# EAGLE design Strain Gauge Amplifier (EAGLE 9.6.2)
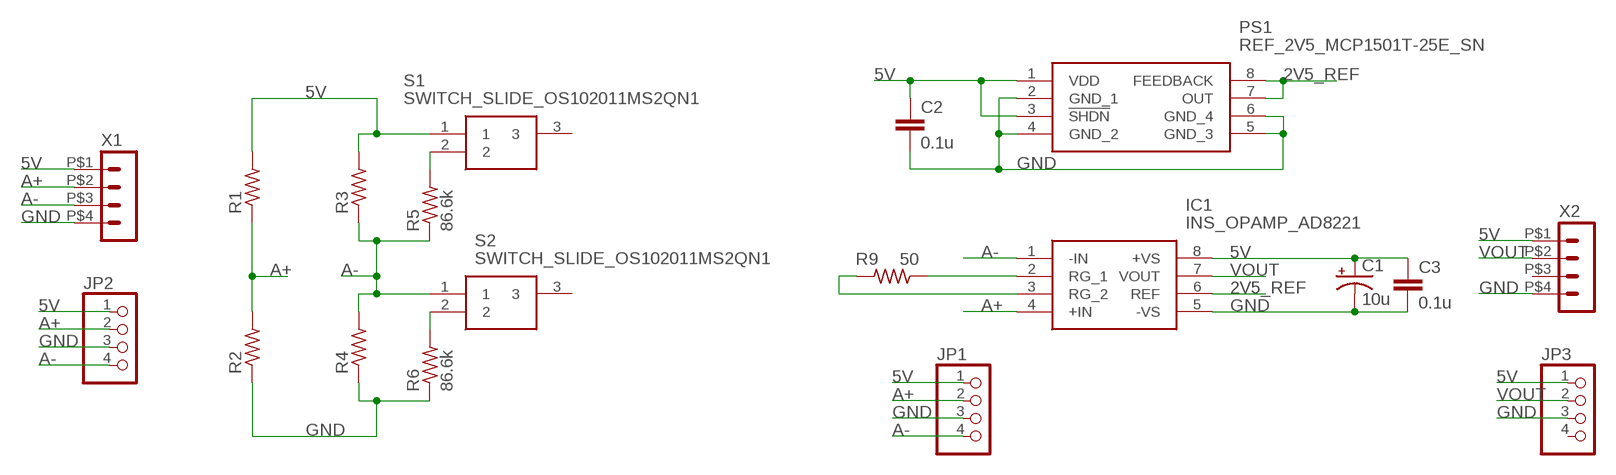
[diagram p0: schematic, sheet 1]

## Parts
C1  10u  CAP_THTE2-5  [E2-5]
C2  0.1u  CAP_SMDC0603  [C0603]
C3  0.1u  CAP_SMDC0603  [C0603]
IC1  INS_OPAMP_AD8221  [SOP65P490X110-8N]
JP1  PINHD-1X4  [1X04]
JP2  PINHD-1X4  [1X04]
JP3  PINHD-1X4  [1X04]
PS1  REF_2V5_MCP1501T-25E_SN  [SOIC127P600X175-8N]
R1  RES_SMDR1206  [R1206]
R2  RES_SMDR1206  [R1206]
R3  RES_SMDR1206  [R1206]
R4  RES_SMDR1206  [R1206]
R5  86.6k  RES_SMDR0603  [R0603]
R6  86.6k  RES_SMDR0603  [R0603]
R9  50  RES_SMDR0603  [R0603]
S1  SWITCH_SLIDE_OS102011MS2QN1  [OS102011MA1QN1]
S2  SWITCH_SLIDE_OS102011MS2QN1  [OS102011MA1QN1]
X1  HEADER_POS4_43045-0401  [43045-0400]
X2  HEADER_POS4_43045-0401  [43045-0400]

## Nets
2V5_REF: IC1.6(REF) PS1.7(OUT) PS1.8(FEEDBACK)
5V: C1.+ C2.1 C3.1 IC1.8(+VS) JP1.1 JP2.1 JP3.1 PS1.1(VDD) PS1.3(!SHDN) R1.2 R3.2 S1.1 X1.P$1 X2.P$1
A+: IC1.4(+IN) JP1.2 JP2.2 R1.1 R2.2 X1.P$2
A-: IC1.1(-IN) JP1.4 JP2.4 R3.1 R4.2 R5.1 S2.1 X1.P$3
GND: C1.- C2.2 C3.2 IC1.5(-VS) JP1.3 JP2.3 JP3.3 PS1.2(GND_1) PS1.4(GND_2) PS1.5(GND_3) PS1.6(GND_4) R2.1 R4.1 R6.1 X1.P$4 X2.P$4
N$1: R6.2 S2.2
N$2: IC1.2(RG_1) R9.1
N$3: IC1.3(RG_2) R9.2
N$5: R5.2 S1.2
VOUT: IC1.7(VOUT) JP3.2 X2.P$2
Unconnected: JP3.4 S1.3 S2.3 X2.P$3

## Library data of the parts
C1 = GTOR - Passive Components:CAP_THT: POLARIZED CAPACITOR, American symbol; SPICEPREFIX: C
C2 C3 = GTOR - Passive Components:CAP_SMD: CAPACITOR, European symbol; SPICEPREFIX: C
IC1 = GTOR - Active Components:INS_OPAMP_AD8221: ANALOG DEVICES - AD8221ARMZ-R7 - INSTRUMENTATION AMPLIFIER, 825KHZ, MSOP8 Source: Datasheet <http://www.analog.com/media/en/technical-documentation/data-sheets/AD8221.pdf>; ARROW_PART_NUMBER: AD8221ARMZ-R7; ARROW_PRICE-STOCK: https://www.arrow.com/en/products/ad8221armz-r7/analog-devices; DESCRIPTION: ANALOG DEVICES - AD8221ARMZ-R7 - INSTRUMENTATION AMPLIFIER, 825KHZ, MSOP8; HEIGHT: 1.1mm; MANUFACTURER_NAME: Analog Devices; MANUFACTURER_PART_NUMBER: AD8221ARMZ-R7; MOUSER_PART_NUMBER: 584-AD8221ARMZ-R7; MOUSER_PRICE-STOCK: https://www.mouser.co.uk/ProductDetail/Analog-Devices/AD8221ARMZ-R7?qs=%2FtpEQrCGXCyX3gxQaWBZmg%3D%3D
JP1-JP3 = GTOR - Connectors:PINHD-1X4: PIN HEADER
PS1 = GTOR - Active Components:REF_2V5_MCP1501T-25E_SN: Voltage References High Prec Buffered Voltage Reference Source: Datasheet <http://ww1.microchip.com/downloads/en/DeviceDoc/20005474E.pdf>; ARROW_PART_NUMBER: MCP1501T-25E/SN; ARROW_PRICE-STOCK: https://www.arrow.com/en/products/mcp1501t-25esn/microchip-technology; DESCRIPTION: Voltage References High Prec Buffered Voltage Reference; HEIGHT: 1.75mm; MANUFACTURER_NAME: Microchip; MANUFACTURER_PART_NUMBER: MCP1501T-25E/SN; MOUSER_PART_NUMBER: 579-MCP1501T-25E/SN; MOUSER_PRICE-STOCK: https://www.mouser.co.uk/ProductDetail/Microchip-Technology/MCP1501T-25E-SN?qs=BA62vJVifGq6P0twjIFVRA%3D%3D
R1-R6 R9 = GTOR - Passive Components:RES_SMD: RESISTOR, American symbol; SPICEPREFIX: R
S1 S2 = GTOR - Active Components:SWITCH_SLIDE_OS102011MS2QN1: Switch Slide Miniature SPDT 0.1A 12VDC Through Hole Slide Switch SPDT On-On 0.1 A@ 12 V dc Slide Source: Datasheet <http://www.ckswitches.com/media/1428/os.pdf>; ARROW_PART_NUMBER: OS102011MS2QN1; ARROW_PRICE-STOCK: https://www.arrow.com/en/products/os102011ms2qn1/ck; DESCRIPTION: Switch Slide Miniature SPDT 0.1A 12VDC Through Hole Slide Switch SPDT On-On 0.1 A@ 12 V dc Slide; HEIGHT: mm; MANUFACTURER_NAME: C & K COMPONENTS; MANUFACTURER_PART_NUMBER: OS102011MS2QN1; MOUSER_PART_NUMBER: 611-OS102011MS2QN1; MOUSER_PRICE-STOCK: https://www.mouser.co.uk/ProductDetail/CK/OS102011MS2QN1?qs=WtljUlYws5RvQ1hEv876nQ%3D%3D
X1 X2 = GTOR - Microfit Connector:HEADER_POS4_?: Molex - Micro-Fit 3.0 Series connector, 3.00mm (0.118") pitch header, 4 positions.

## Board
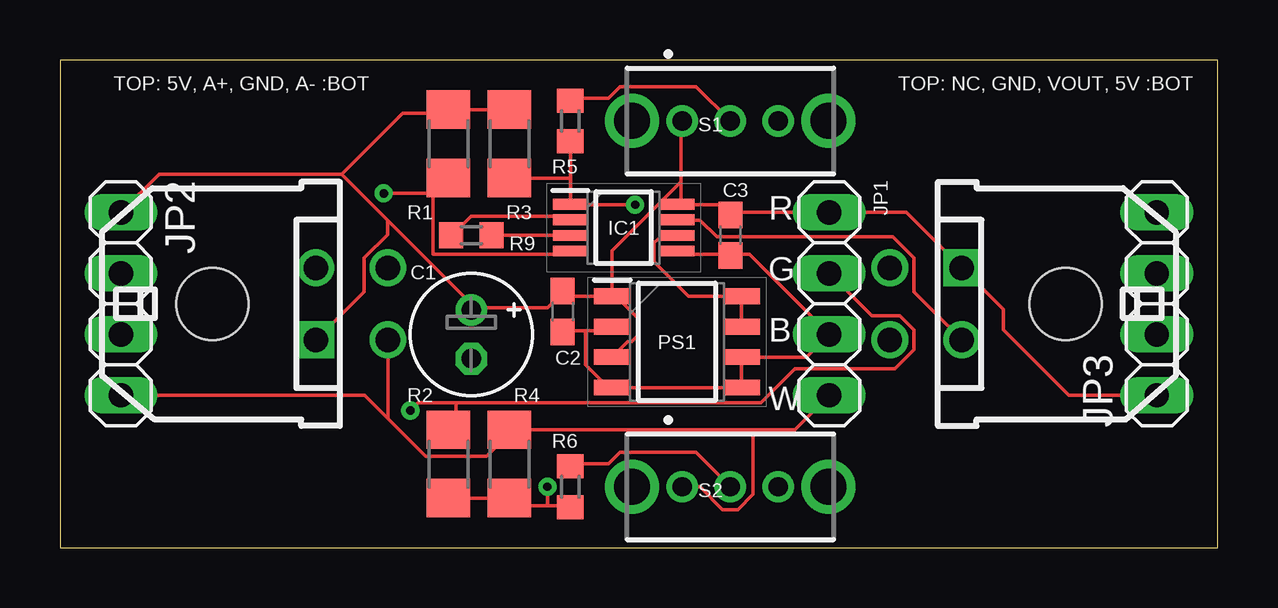
[diagram p1: board, top side]
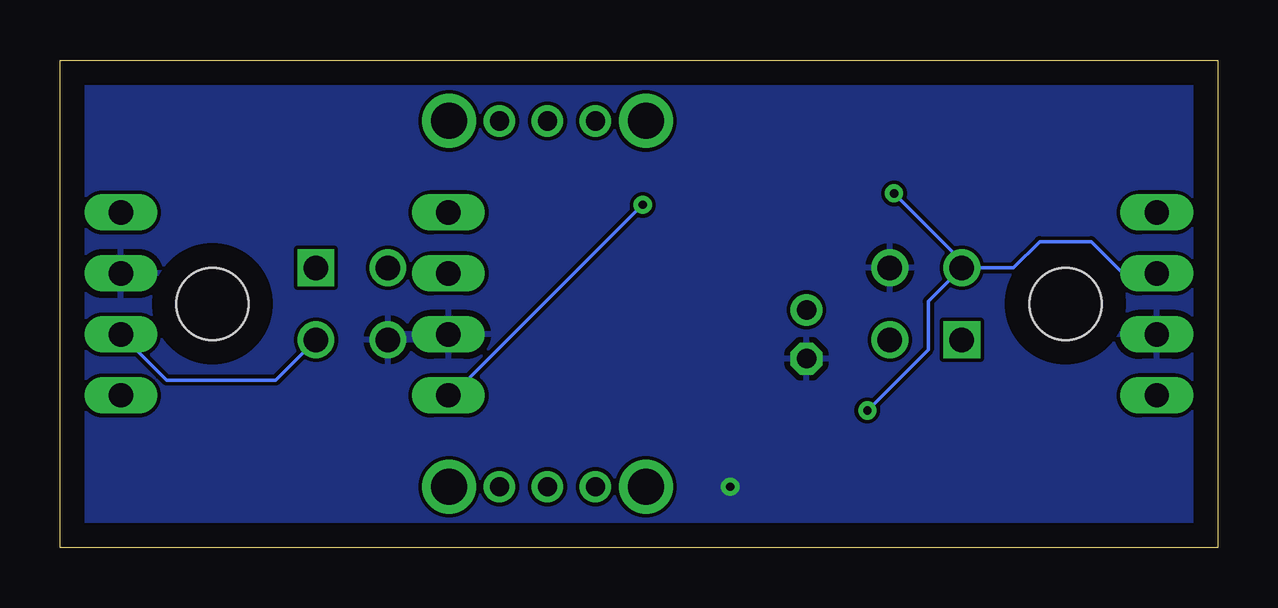
[diagram p2: board, bottom side, seen from below]

Size 48.26 x 20.32 mm. Coordinates in mm from the lower left corner, seen from the top.
Outline: 0,0 48.26,0 48.26,20.32 0,20.32 0,0
Copper layers (1*16): Top 0.035mm / dielectric 1.5mm / Bottom 0.035mm
Design rules "default": minimum track width 6mil, minimum drill 0.35mm, track to track 6mil, track to pad 6mil, pad to pad 6mil, via to via 6mil, smd to smd 6mil, copper to edge 40mil, drill to drill 6mil, minimum pad ring 10mil, minimum via ring 8mil, stop-mask expansion 4mil, vias tented up to drill 0mil, thermal gap 10mil

### Footprints (pad centres in the part's own frame; a part is rotated, then mirrored left to right if it is on the bottom)
E2-5 = drill 0.813 pad 1.27: + -1.016,0 | drill 0.813 pad 1.27 octagon: - 1.016,0
C0603 = smd 1.1 x 1: 1 -0.85,0; 2 0.85,0
SOP65P490X110-8N = smd 1.45 x 0.45: 1 -2.225,0.975; 2 -2.225,0.325; 3 -2.225,-0.325; 4 -2.225,-0.975; 5 2.225,-0.975; 6 2.225,-0.325; 7 2.225,0.325; 8 2.225,0.975
1X04 = drill 1.016 long: 1 -3.81,0; 2 -1.27,0; 3 1.27,0; 4 3.81,0
SOIC127P600X175-8N = smd 1.5 x 0.65: 1 -2.7,1.905; 2 -2.7,0.635; 3 -2.7,-0.635; 4 -2.7,-1.905; 5 2.7,-1.905; 6 2.7,-0.635; 7 2.7,0.635; 8 2.7,1.905
R1206 = smd 1.6 x 1.803: 1 -1.422,0; 2 1.422,0
R0603 = smd 1 x 1.1: 1 -0.85,0; 2 0.85,0
OS102011MA1QN1 = drill 0.8 pad 1.3: 1 -2,0; 2 0,0; 3 2,0 | drill 1.5 pad 2.25: 4 -4.1,0; 5 4.1,0
43045-0400 = drill 1.02 square: P$1 1.5,4.32 | drill 1.02: P$2 -1.5,4.32; P$3 1.5,7.32; P$4 -1.5,7.32 | hole 3: 0,0

### Placement (x,y rotation side)
C1  17.14,8.89 270 top
C2  20.95,9.84 270 top
C3  27.94,13.02 270 top
IC1  23.5,13.34 0 top
JP1  32.07,10.16 270 top
JP2  2.54,10.16 270 top
JP3  45.72,10.16 90 top
PS1  25.72,8.57 0 top
R1  16.19,16.83 90 top
R2  16.19,3.49 90 top
R3  18.73,16.83 90 top
R4  18.73,3.49 90 top
R5  21.27,17.78 90 top
R6  21.27,2.54 90 top
R9  17.14,13.02 0 top
S1  27.94,17.78 0 top
S2  27.94,2.54 0 top
X1  6.35,10.16 270 top
X2  41.91,10.16 90 top

### Tracks (layer width: path | path; a pad name or v marks a point on that pad's centre or on a via)
2V5_REF
  Top 0.152: PS1.8 26.19,10.48 24.77,11.91 24.77,12.7 24.92,12.86 25.72,12.86 IC1.6 | PS1.8 PS1.7 | PS1.8
5V
  Top 0.152: R3.2 R1.2 16.19,18.1 14.29,18.1 11.75,15.56 | PS1.3 23.65,8.57 23.81,8.57 24.13,8.89 24.13,9.53 23.18,10.48 PS1.1 | 17.3,10 20.32,10 20.95,10.64 C2.1 21.17,10.48 PS1.1 | 17.3,10 17.14,10 C1.+ 17.3,10 | 25.88,15.24 25.88,17.78 S1.1 | 25.88,15.24 25.88,14.45 IC1.8 25.88,14.29 27.62,14.29 27.94,13.97 | 27.94,13.97 JP1.1 35.28,13.97 X2.P$1 39.32,9.93 39.32,9.09 42.05,6.35 JP3.1 | 27.94,13.97 C3.1 | 17.3,10 13.65,13.65 | 13.65,13.65 11.75,15.56 | PS1.1 23.02,12.38 25.88,15.24 | 11.75,15.56 4.13,15.56 JP2.1 | 13.65,13.65 13.65,13.05 12.68,12.07 12.68,10.67 X1.P$1
A+  (via drill 0.35)
  Top 0.152: 15.56,14.76 15.56,12.22 21.11,12.22 IC1.4 | 15.56,14.76 16.19,15.4 R1.1 15.56,14.76 | 15.56,14.76 v13.49,14.76 | JP1.2 33.84,9.65 35,9.65 35.58,9.07 35.58,8.25 34.8,7.46 30.64,7.46 29.21,6.03 16.51,6.03 | v14.61,5.71 14.92,6.03 16.51,6.03 | 16.51,6.03 16.51,5.23 R2.2
  Bottom 0.152: v13.49,14.76 10.67,11.94 X1.P$2 | JP2.2 3.95,11.43 5.28,12.75 7.42,12.75 8.52,11.66 X1.P$2 | X1.P$2 12.06,10.27 12.06,8.26 v14.61,5.71
A-  (via drill 0.35)
  Top 0.152: 21.27,15.4 21.27,14.45 IC1.1 21.27,14.29 v23.97,14.29 | 21.27,15.4 R5.1 | 21.27,15.4 18.73,15.4 R3.1 | 28.89,4.92 18.73,4.92 R4.2 18.73,4.76 17.78,3.81 15.24,3.81 13.67,5.38 | S2.1 26.67,2.54 27.62,1.59 28.26,1.59 28.89,2.22 28.89,4.92 | 13.67,5.38 X1.P$3 | JP2.4 12.7,6.35 13.67,5.38 | JP1.4 30.64,4.92 28.89,4.92
  Bottom 0.152: v23.97,14.29 31.91,6.35 JP1.4
GND  (via drill 0.35)
  Top 0.152: PS1.5 PS1.6 31.11,7.94 JP1.3 28.73,12.22 27.94,12.22 | 21.91,9.05 22.7,9.05 22.86,9.21 PS1.2 | 21.91,9.05 20.95,9.05 C2.2 | 21.91,9.05 21.91,7.62 22.86,6.67 PS1.4 PS1.5 | PS1.5 | 20.32,1.75 19.05,1.75 R4.1 | 20.32,1.75 21.27,1.75 R6.1 | R4.1 R2.1 | R4.1 | 27.94,12.22 25.88,12.22 IC1.5 | 27.94,12.22 C3.2 | v20.32,2.54 20.32,1.75
  pour Bottom: 0,20.32 0,0 48.26,0 48.26,20.32
N$1
  Top 0.152: S2.2 26.51,3.97 23.34,3.97 22.86,3.49 21.27,3.49 R6.2
N$2
  Top 0.152: R9.1 16.35,13.02 17.14,13.81 21.11,13.81 IC1.2
N$3
  Top 0.152: R9.2 21.11,13.02 IC1.3
N$5
  Top 0.152: S1.2 26.51,19.21 23.34,19.21 22.86,18.73 21.27,18.73 R5.2
VOUT
  Top 0.152: IC1.7 25.88,13.65 26.67,13.65 27.38,12.95 34.71,12.95 35.58,12.07 35.58,10.67 X2.P$2
  Bottom 0.152: X2.P$2 39.27,6.99 43.81,6.99 JP3.2

### Text on the board
tNames: TOP: 5V, A+, GND, A- :BOT | TOP: NC, GND, VOUT, 5V :BOT | R | G | B | W